# EAGLE schematic usb_wro300_cpu (EAGLE 4.15)
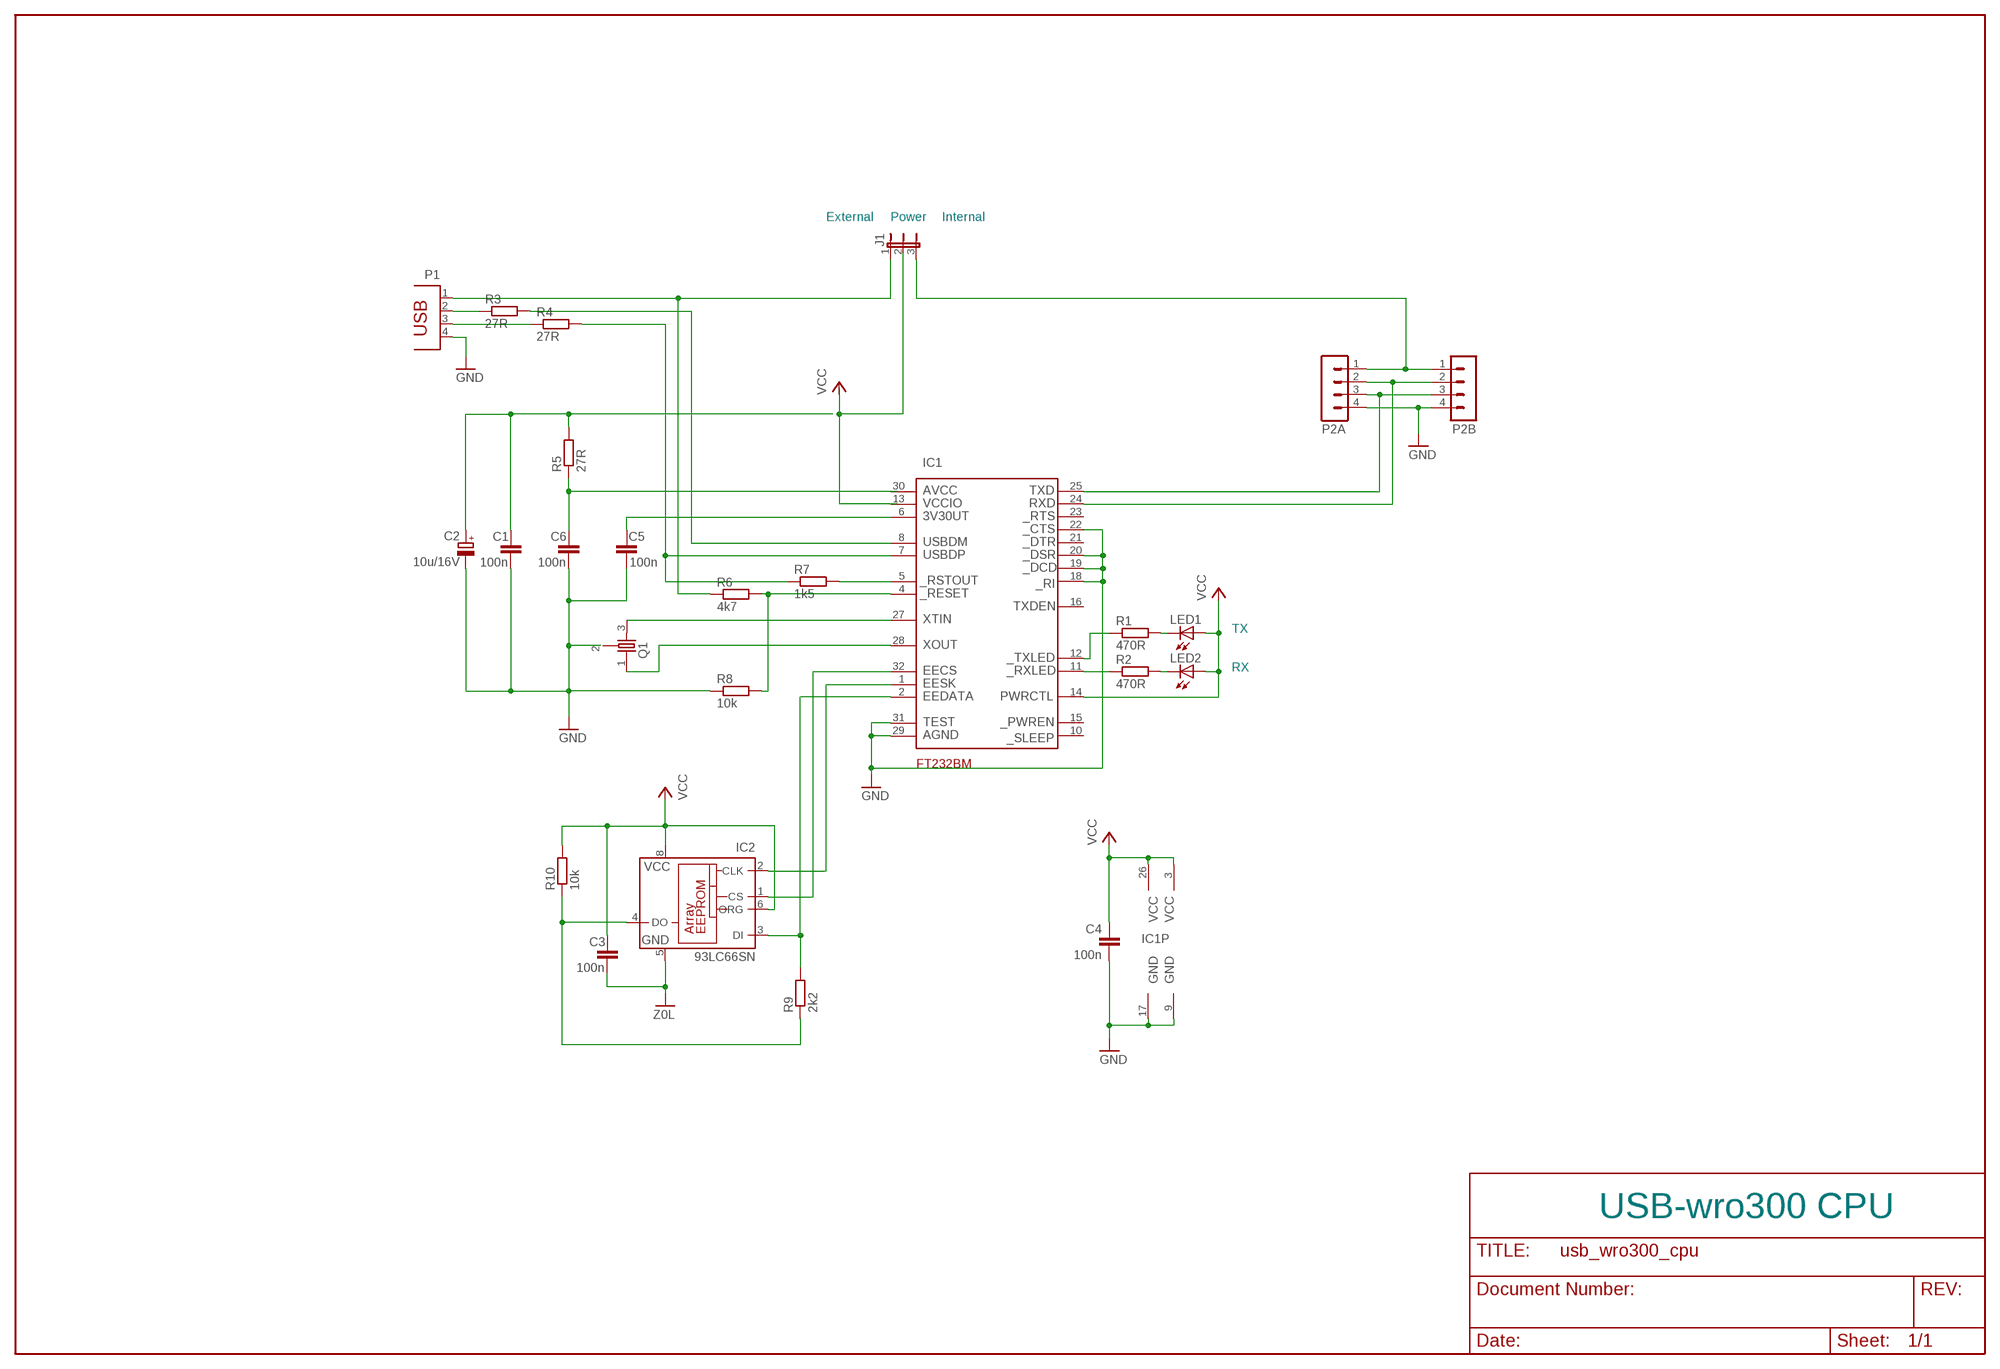
[diagram p0: schematic, sheet 1]

## Parts
C1  100n  C-EUC0805K  [C0805K]
C2  10u/16V  CPOL-EUB  [PANASONIC_B]
C3  100n  C-EUC0805K  [C0805K]
C4  100n  C-EUC0805K  [C0805K]
C5  100n  C-EUC0805K  [C0805K]
C6  100n  C-EUC0805K  [C0805K]
IC1  FT232BM  [TQFP32-08]
IC2  93LC66SN  [SO-08]
J1  JUMPER3  [JUMPER3]
LED1  LED3MM  [LED3MM]
LED2  LED3MM  [LED3MM]
P1  PN61729  [PN61729]
P2A  MA04-1  [MA04-1]
P2B  MA04-1  [MA04-1]
Q1  MURATA_RESONATOR  [MURATA_RESONATOR]
R1  470R  R-EU_M0805  [M0805]
R2  470R  R-EU_M0805  [M0805]
R3  27R  R-EU_M0805  [M0805]
R4  27R  R-EU_M0805  [M0805]
R5  27R  R-EU_M0805  [M0805]
R6  4k7  R-EU_M0805  [M0805]
R7  1k5  R-EU_M0805  [M0805]
R8  10k  R-EU_M0805  [M0805]
R9  2k2  R-EU_M0805  [M0805]
R10  10k  R-EU_M0805  [M0805]

## Nets
0V: C1.2 C2.- C3.2 C4.2 C5.2 C6.2 IC1.9 IC1.17 IC1.18 IC1.19 IC1.20 IC1.22 IC1.29 IC1.31 IC2.5(GND) P1.4 P2A.4 P2B.4 Q1.2 R8.1 ; supply symbol labelled GND, Z0L
N$1: IC1.12 R1.1
N$2: IC1.25 P2A.3 P2B.3
N$3: IC1.11 R2.1
N$4: IC1.1 IC2.2(CLK)
N$5: LED1.K(C) R1.2
N$6: LED2.K(C) R2.2
N$8: P1.2 R3.1
N$9: IC1.8 R3.2
N$10: P1.3 R4.1
N$11: IC1.7 R4.2 R7.1
N$12: C1.1 C2.+ R5.2
N$13: C6.1 IC1.30 R5.1
N$15: IC1.24 P2A.2 P2B.2
N$16: IC1.32 IC2.1(CS)
N$17: C5.1 IC1.6
N$18: IC1.27 Q1.3
N$19: IC1.28 Q1.1
N$20: IC1.5 R7.2
N$21: IC1.2 IC2.3(DI) R9.2
N$22: IC1.4 R6.2 R8.2
N$25: J1.3 P2A.1 P2B.1
N$31: J1.1 P1.1 R6.1
N$46: IC2.4(DO) R9.1 R10.1
VCC: C3.1 C4.1 IC1.3 IC1.14 IC1.26 IC2.6(ORG) IC2.8(VCC) LED1.A LED2.A R10.2
Unconnected: IC1.10 IC1.13 IC1.15 IC1.16 IC1.21 IC1.23 IC2.7(NU) J1.2

## Notes on the sheet
- External | Power | Internal
- TX
- RX
- USB-wro300 CPU

## Library data of the parts
C1 C3-C6 = rcl:C-EU: CAPACITOR, European symbol
C2 = rcl:CPOL-EU: POLARIZED CAPACITOR, European symbol
IC1 = lbm:FT232BM: MICROCONTROLLER 2 Kbytes FLASH 128 bytes SRAM 128 bytes EEPROM UART 6-channel 10-bit ADC
IC2 = microchip:93*: Serial EPROM 1 K/2 K/4 K, low voltage, Microwire
J1 = lbm:JUMPER3
LED1 LED2 = led:LED: LED OSRAM: - CHIPLED LG R971, LG N971, LY N971, LG Q971, LY Q971, LO R971, LY R971 LH N974, LH R974 LS Q976, LO Q976, LY Q976 LO Q996 - Hyper CHIPLED LW Q18S LB Q993, LB Q99A, LB R99A - SideLED LS A670, LO A670, LY A670, LG A670, LP A670 LB A673, LV A673, LT A673, LW A673 LH A674 LY A675 LS A676, LA A676, LO A676, LY A676, LW A676 LS A679, LY A679, LG A679 - Hyper Micro SIDELED® LS Y876, LA Y876, LO Y876, LY Y876 LT Y87S - SmartLED LW L88C, LW L88S LB L89C, LB L89S, LG L890 LS L89K, LO L89K, LY L89K LS L896, LA L896, LO L896, LY L896 - TOPLED LS T670, LO T670, LY T670, LG T670, LP T670 LSG T670, LSP T670, LSY T670, LOP T670, LYG T670 LG T671, LOG T671, LSG T671 LB T673, LV T673, LT T673, LW T673 LH T674 LS T676, LA T676, LO T676, LY T676, LB T676, LH T676, LSB T676, LW T676 LB T67C, LV T67C, LT T67C, LS T67K, LO T67K, LY T67K, LW E67C LS E67B, LA E67B, LO E67B, LY E67B, LB E67C, LV E67C, LT E67C LW T67C LS T679, LY T679, LG T679 LS T770, LO T770, LY T770, LG T770, LP T770 LB T773, LV T773, LT T773, LW T773 LH T774 LS E675, LA E675, LY E675, LS T675 LS T776, LA T776, LO T776, LY T776, LB T776 LHGB T686 LT T68C, LB T68C - Hyper Mini TOPLED® LB M676 - Mini TOPLED Santana® LG M470 LS M47K, LO M47K, LY M47K Source: http://www.osram.convergy.de/
P1 = con-berg:PN61729: BERG USB connector
P2A P2B = con-lstb:MA04-1: PIN HEADER
Q1 = lbm:MURATA_RESONATOR
R1-R10 = rcl:R-EU_: RESISTOR, European symbol